# Altium schematic sheet 2  - Power Switch.SchDoc
size A4
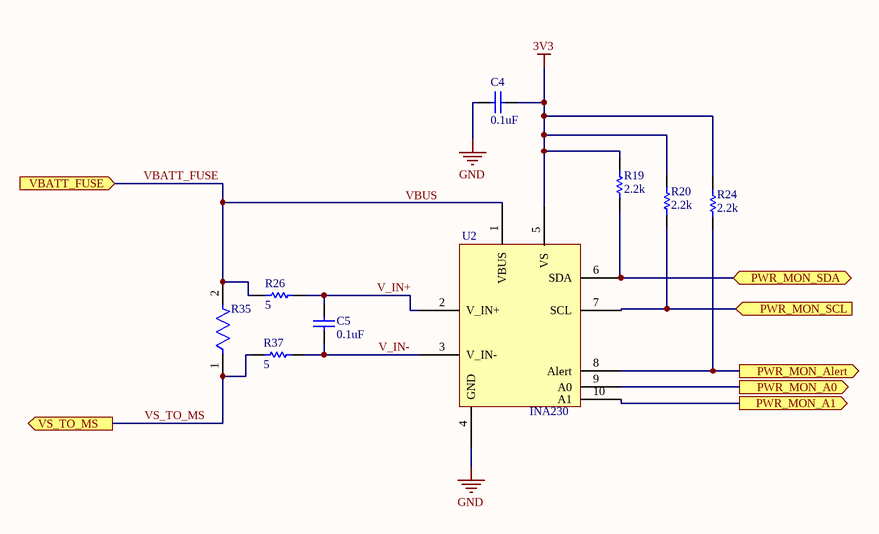
[diagram p0: 2  - Power Switch.SchDoc]

## Parts
C4  value 0.1uF  [0603R-generic]  (hidden comment: Cap)
C5  value 0.1uF  [0603R-generic]  (hidden comment: Cap)
R19  2.2k  [RESC0603(1608)_L]
R20  2.2k  [RESC0603(1608)_L]
R24  2.2k  [RESC0603(1608)_L]
R26  5  [RESC0603(1608)_L]
R35  WSLF25122L000FEA  [FP-WSLF25122L000FEA-MFG]  (value not drawn)
R37  5  [RESC0603(1608)_L]
U2  INA230  [SOP50P490X110-10N]

## Ports
PWR_MON_A0 (out), PWR_MON_A1 (out), PWR_MON_Alert (out), PWR_MON_SCL (in), PWR_MON_SDA (bidir), VBATT_FUSE (in), VS_TO_MS (out)

## Nets
3V3: C4.1 R19.2 R20.2 R24.2 U2.5(VS)
GND: C4.2 U2.4(GND)
PWR_MON_A0: U2.9(A0) ; port PWR_MON_A0
PWR_MON_A1: U2.10(A1) ; port PWR_MON_A1
PWR_MON_Alert: R24.1 U2.8(Alert) ; port PWR_MON_Alert
PWR_MON_SCL: R20.1 U2.7(SCL) ; port PWR_MON_SCL
PWR_MON_SDA: R19.1 U2.6(SDA) ; port PWR_MON_SDA
V_IN+: C5.2 R26.1 U2.2(V_IN+)
V_IN-: C5.1 R37.1 U2.3(V_IN-)
VBATT_FUSE: R26.2 R35.2 U2.1(VBUS) ; port VBATT_FUSE
VS_TO_MS: R35.1 R37.2 ; port VS_TO_MS

## Notes on the sheet
- Labels drawn without touching a wire or pin: VBUS

## Library data of the parts
C4 C5 = Cap: Capacitor; Manufacturer: Yageo; Manufacturer Part Number: CC1210ZKY5V8BB106; Capacitance: 10µF; Tolerance: -20%, +80%; Voltage - Rated: 25V; Temperature Coefficient: Y5V (F); Supplier 1: Digi-Key; Supplier Part Number 1: 311-2063-1-ND; RoHS: RoHS Compliant; Category: Capacitors; Stock 1: 1156; Pricing 1: 1=0.47, 10=0.323, 25=0.258, 50=0.2154, 100=0.1829, 250=0.14528, 500=0.12912, 1000=0.11298 (CAD); Packaging: Cut Tape (CT); Part Status: Active; Operating Temperature: -30°C ~ 85°C; Features: -; Ratings: -; Applications: General Purpose; Failure Rate: -; Mounting Type: Surface Mount, MLCC; Package / Case: 1210 (3225 Metric); Size / Dimension: 0.126" L x 0.098" W (3.20mm x 2.50mm); Height - Seated (Max): -; Thickness (Max): 0.083" (2.10mm); Lead Spacing: -; Lead Style: -; ComponentLink1URL: http://www.yageo.com/documents/recent/UPY-GPHC_Y5V_6.3V-to-50V_7.pdf; ComponentLink1Description: http://www.yageo.com/documents/recent/UPY-GPHC_Y5V_6.3V-to-50V_7.pdf; Supplier 2: Digi-Key; Supplier Part Number 2: 1276-1869-1-ND
R19 R20 R24 R26 R37 = CMP-1591-00001-1: 0603 (1608 Metric) Chip Resistor; Case-Metric: 1608; Case-EIA: 0603; PackageReference: RESC0603(1608); Supplier 1: Digi-Key; Supplier Part Number 1: P430BZCT-ND
R35 = CMP-02407-012168-1: RES 0.002 OHM 1% 5W 2512; Resistance: 2mR; Temperature Coefficient: 70ppm/°C; RoHS Compliant: Yes; Case/Package: 2512; Length: 0.25inch; Height: 0.024inch; Max Power Dissipation: 5W; Lead Free: Lead Free; Features: Moisture Resistant; Min Operating Temperature: -65°C; Max Operating Temperature: 170°C; Case Code (Metric): 6432; Tolerance: 1%; Width: 0.125inch; Case Code (Imperial): 2512; Packaging: Tape and Reel; Resistor Type: Metal Element; Number of Terminations: 2